# Altium schematic sheet SpO_Sensor.SchDoc
size 420 x 297 mm
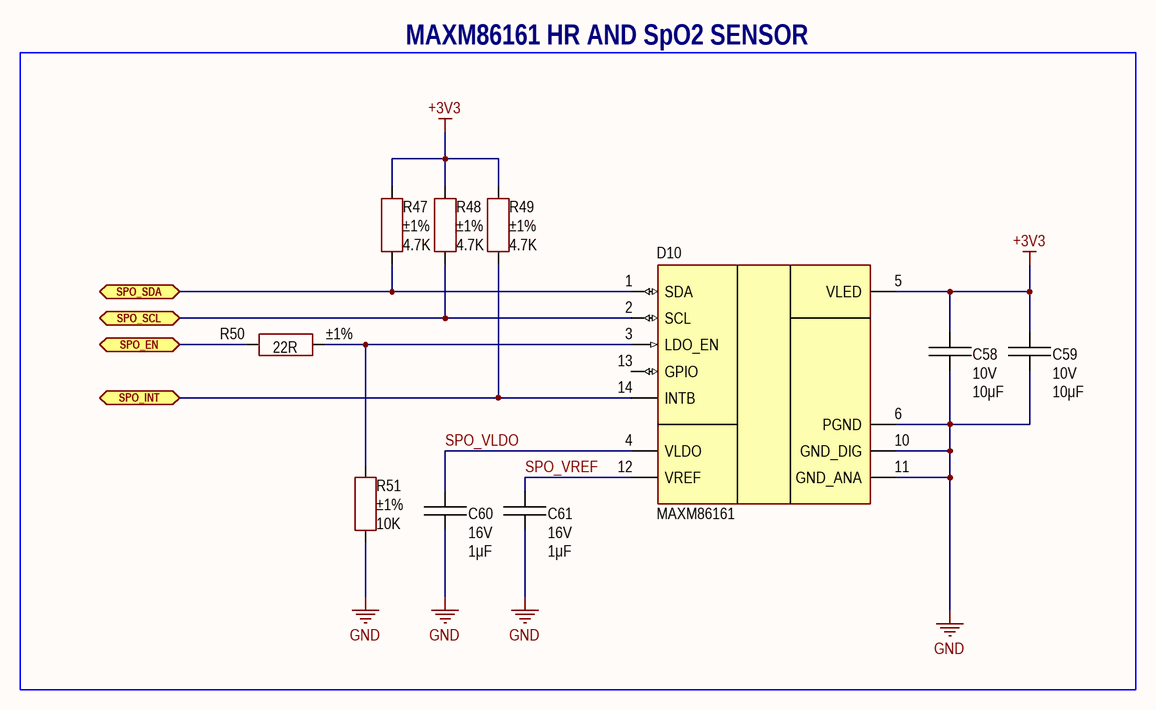
[diagram p0: SpO_Sensor.SchDoc]

## Parts
C58  value 10μF  Voltage: 10V  [CAP: 0805]
C59  value 10μF  Voltage: 10V  [CAP: 0805]
C60  value 1μF  Voltage: 16V  [CAP: 0805]
C61  value 1μF  Voltage: 16V  [CAP: 0805]
D10  (no value)  [IC: 14-OLGA]
R47  value 4.7K  Tolerance: ±1%  [RES: 0805]
R48  value 4.7K  Tolerance: ±1%  [RES: 0805]
R49  value 4.7K  Tolerance: ±1%  [RES: 0805]
R50  value 22R  Tolerance: ±1%  [RES: 0805]
R51  value 10K  Tolerance: ±1%  [RES: 0805]

## Blocks framed on the sheet
MAXM86161 HR AND SpO2 SENSOR: C58-C61 D10 R47-R51

## Ports
SPO_EN (bidir), SPO_INT (bidir), SPO_SCL (bidir), SPO_SDA (bidir)

## Nets
+3V3: C58.2 C59.2 D10.5(VLED) R47.1 R48.1 R49.1
GND: C58.1 C59.1 C60.1 C61.1 D10.6(PGND) D10.10(GND_DIG) D10.11(GND_ANA) R51.2
SPO_EN: R50.1 ; port SPO_EN
SPO_INT: D10.14(INTB) R49.2 ; port SPO_INT
SPO_SCL: D10.2(SCL) R48.2 ; port SPO_SCL
SPO_SDA: D10.1(SDA) R47.2 ; port SPO_SDA
SPO_VLDO: C60.2 D10.4(VLDO)
SPO_VREF: C61.2 D10.12(VREF)
NetD10_3: D10.3(LDO_EN) R50.2 R51.1

Not connected (* = marked no-connect by the designer): D10 13(GPIO)

## Notes on the sheet
- Author
- Manufacturer
- Date
- Page
- Total pages
- Size page
- A3
- Materials

## Library data of the parts
C58 C59 = Ceramic_0805: 10 µF ±10% 10V Ceramic Capacitor X7R 0805 (2012 Metric); Manufacturer: Yageo; PartNumber: CC0805KFX7R6BB106; ValueManufacturerPartNumber: Ceramic capacitor, 10μF, X7R, ±10%, 10V, 0805, -55...+125°C; Package: 0805; HelpURL: https://www.digikey.com/en/products/detail/yageo/CC0805KFX7R6BB106/11611326; Temperature: -55...+125°C; TypeCapacitor: Ceramic capacitor; Tolerance: ±10%; TypeDielectric: X7R
C60 C61 = Ceramic_0805: 1 µF ±10% 16V Ceramic Capacitor X7R 0805 (2012 Metric); Manufacturer: Yageo; PartNumber: CC0805KKX7R7BB105; ValueManufacturerPartNumber: Ceramic capacitor, 1μF, X7R, ±10%, 16V, 0805, -55...+125°C; Package: 0805; HelpURL: https://www.digikey.com/en/products/detail/yageo/CC0805KKX7R7BB105/2103103; Temperature: -55...+125°C; TypeCapacitor: Ceramic capacitor; Tolerance: ±10%; TypeDielectric: X7R
D10 = MAXM86161: HR and SpO2 sensor; Manufacturer: Maxim Integrated; Supply: 3.0...3.3V; HelpURL: https://www.digikey.com/en/products/detail/maxim-integrated/MAXM86161EFD/10258730; Package: 14-OLGA; ComponentType: IC HR and SpO2 sensor; ValueManufacturerPartNumber: =ComponentType+', '+Sensing+', '+Accuracy+', '+GainBandwidth+', '+Sensitivity+', '+Temperature+', '+Package; Temperature: -40°C..+85°C; Sensing: HR and SpO2 sensor; PartNumber: MAXM86161
R47-R49 = Resistor_0805: 4.7 kOhms ±5% 0.125W, 1/8W Chip Resistor 0805 (2012 Metric) Moisture Resistant Thick Film; Manufacturer: Yageo; PartNumber: RC0805JR-074K7L; ValueManufacturerPartNumber: Resistor film, 4.7K, ±1%, 0805, 0.125W, -55...+125°C; TypeResistor: Resistor film; Package: 0805; HelpURL: https://www.digikey.com/en/products/detail/yageo/RC0805JR-074K7L/728327; Temperature: -55...+125°C; Power: 0.125W
R50 = Resistor_0805: 22 Ohms ±1% 0.125W, 1/8W Chip Resistor 0805 (2012 Metric) Moisture Resistant Thick Film; Manufacturer: Yageo; PartNumber: RC0805FR-0722RL; ValueManufacturerPartNumber: Resistor film, 22R, ±1%, 0805, 0.125W, -55...+125°C; TypeResistor: Resistor film; Package: 0805; HelpURL: https://www.digikey.com/en/products/detail/yageo/RC0805FR-0722RL/727735; Temperature: -55...+125°C; Power: 0.125W
R51 = Resistor_0805: 10 kOhms ±1% 0.125W, 1/8W Chip Resistor 0805 (2012 Metric) Moisture Resistant Thick Film; Manufacturer: Yageo; PartNumber: RC0805FR-0710KL; ValueManufacturerPartNumber: Resistor film, 10K, ±1%, 0805, 0.125W, -55...+125°C; TypeResistor: Resistor film; Package: 0805; HelpURL: https://www.digikey.com/en/products/detail/yageo/RC0805FR-0710KL/727535; Temperature: -55...+125°C; Power: 0.125W